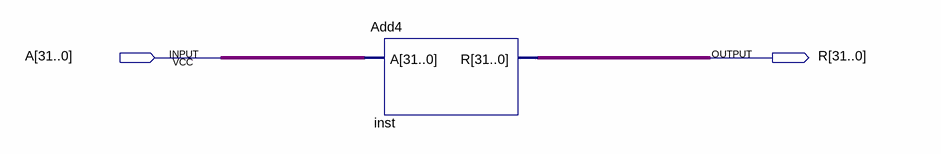
[diagram p0: schematic sheet]
// Quartus schematic TesteAdd4.bdf as structural Verilog: 1 symbols, 2 pins
module TesteAdd4 (
  input  [31:0] A,
  output [31:0] R
);

  Add4 inst (.A(A), .R(R));
endmodule
